# EasyEDA Pro project Propj-AlmuxCybernet.epro, schematic example
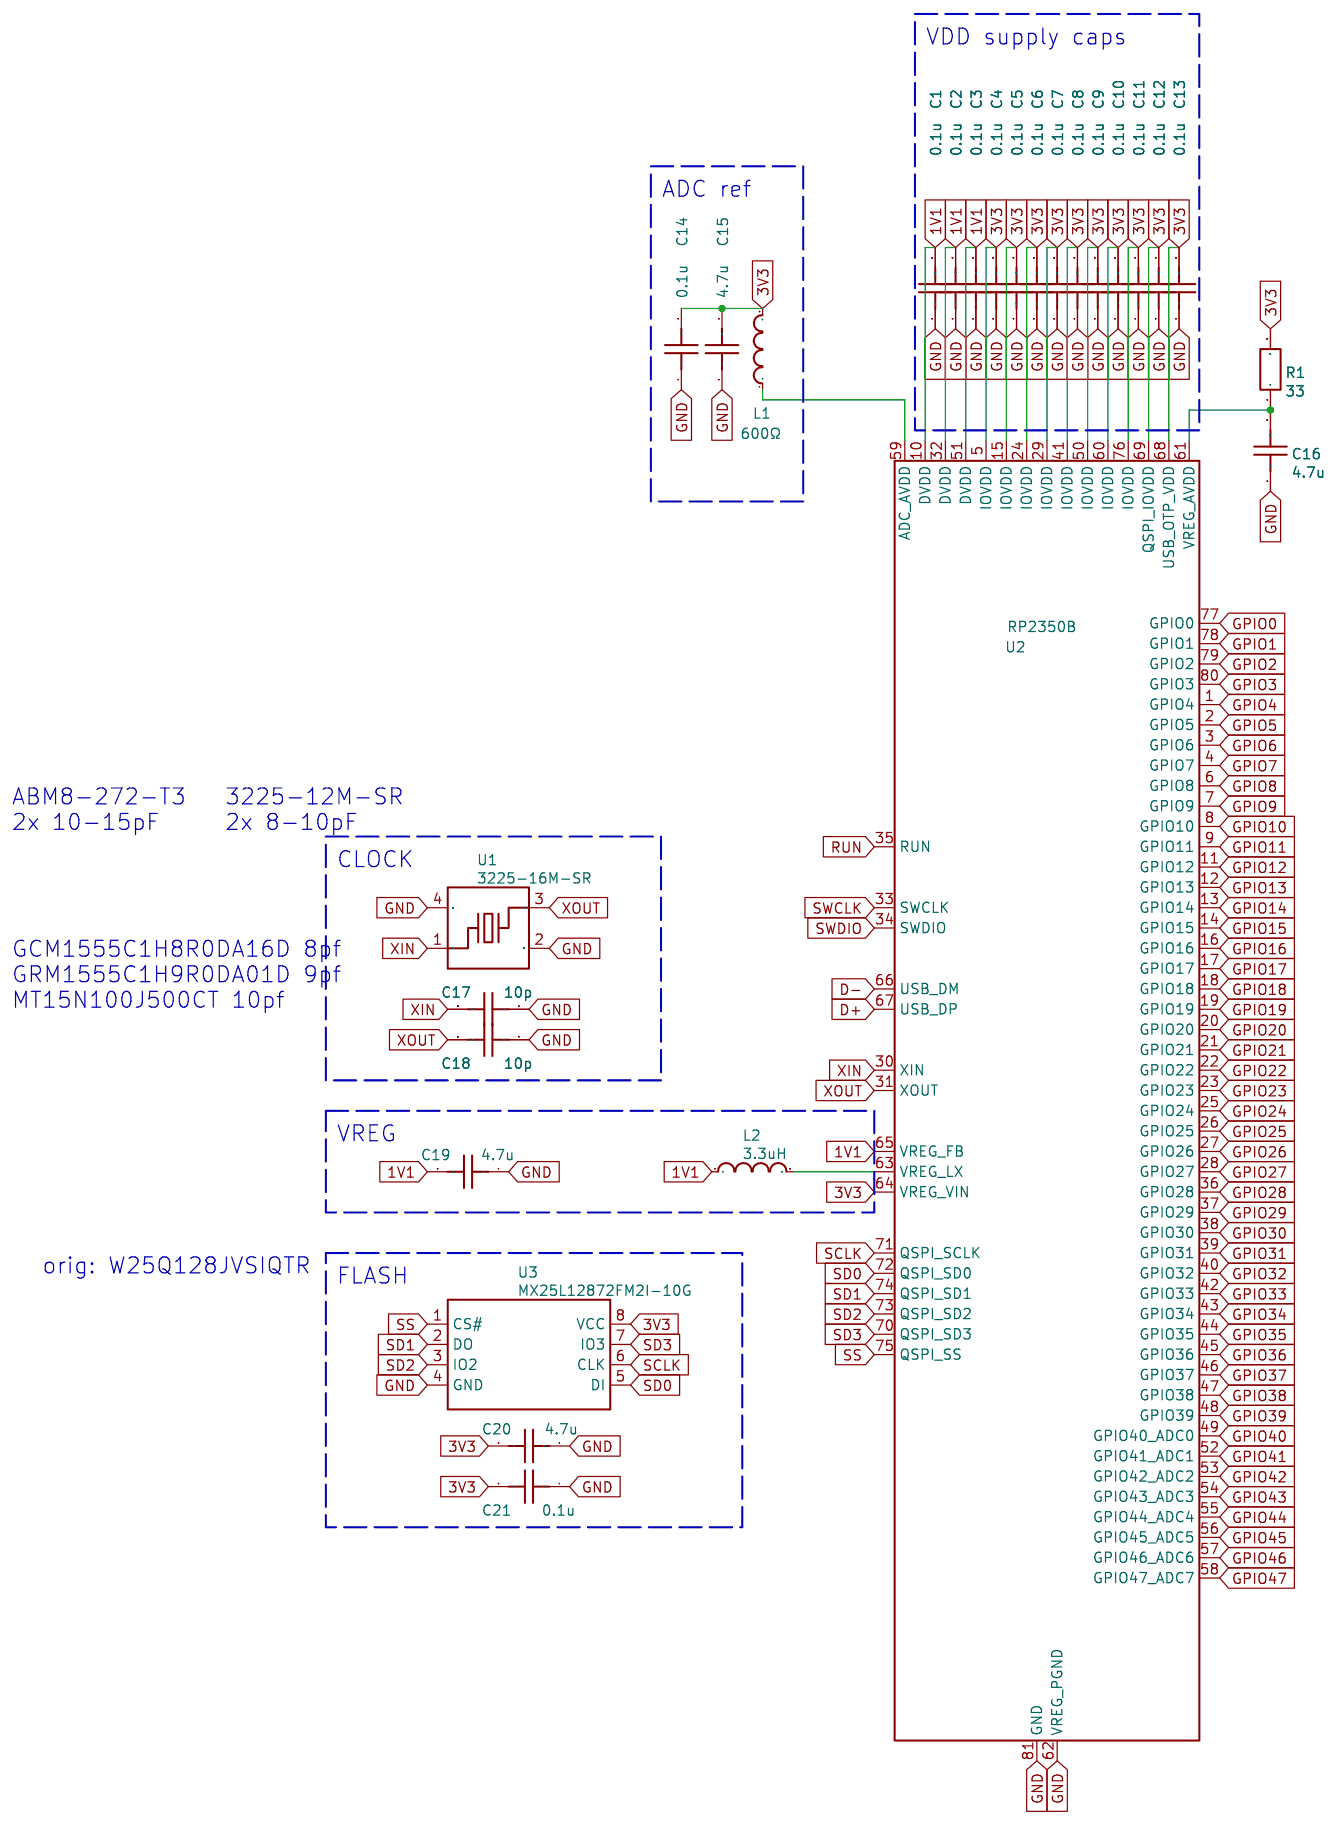
[diagram p0: schematic sheet]

## Parts
C1  0.1u  [C0402]
C2  0.1u  [C0402]
C3  0.1u  [C0402]
C4  0.1u  [C0402]
C5  0.1u  [C0402]
C6  0.1u  [C0402]
C7  0.1u  [C0402]
C8  0.1u  [C0402]
C9  0.1u  [C0402]
C10  0.1u  [C0402]
C11  0.1u  [C0402]
C12  0.1u  [C0402]
C13  0.1u  [C0402]
C14  0.1u  [C0402]
C15  4.7u  [C0603]
C16  4.7u  [C0603]
C17  10p  [C0402]
C18  10p  [C0402]
C19  4.7u  [C0603]
C20  4.7u  [C0603]
C21  0.1u  [C0402]
L1  600Ω  [L0603]
L2  3.3uH  [L1008]
R1  33  [R0402]
U1  3225-16M-SR  [CRYSTAL-SMD_4P-L3.2-W2.5-BL]
U2  RP2350B  [QFN-80_L10.0-W10.0-P0.40-TL-EP3.4]
U3  MX25L12872FM2I-10G  [SOIC-8_L5.3-W5.3-P1.27-LS8.0-BL]

## Library data of the parts
C1-C14 C21 = 0.1u: Supplier Part: CL05B104KP5NNNC; Supplier: Tme; Manufacturer Part: CL05B104KP5NNNC; Manufacturer: SAMSUNG; nameAlias: Value(F); Contributor: LCEDA_Lib; spicePre: C; spiceSymbolName: C_0402_US
C15 C16 C19 C20 = 4.7u: Supplier Part: 0603X475K100CT; Supplier: Tme; Manufacturer Part: 0603X475K100CT; Manufacturer: WALSIN; nameAlias: Value(F); Contributor: LCEDA_Lib; spicePre: C; spiceSymbolName: C_0402_US
C17 C18 = 10p: Supplier Part: MT15N100J500CT; Supplier: Tme; Manufacturer Part: MT15N100J500CT; Manufacturer: WALSIN; nameAlias: Value(F); Contributor: LCEDA_Lib; spicePre: C; spiceSymbolName: C_0402_US
L1 = 600Ω: Supplier: Tme; Manufacturer: muRata; Manufacturer Part: BLM18HE601SN1D; Supplier Part: BLM18HE601SN1D; nameAlias: Value; spicePre: L; spiceSymbolName: BLM18HE601SN1D
L2 = 3.3uH: Supplier: Tme; Supplier Part: LQM2HPN3R3MG0L; Manufacturer: MURATA; Manufacturer Part: LQM2HPN3R3MG0L; nameAlias: Value; Contributor: Nephrite; spicePre: L; spiceSymbolName: AOTA-B201610S3R3-101-T
R1 = 33: Supplier Part: HP02-33R1%; Supplier: Tme; Manufacturer Part: HP02WAF330JTCE; Manufacturer: ROYALOHM; nameAlias: Value(Ω); Contributor: LCEDA_Lib; spicePre: R; spiceSymbolName: R_0402_EU
U1 = 3225-16M-SR: Supplier: Tme; Supplier Part: 3225-12M-SR; Manufacturer: SR Passives; Contributor: lcsc; spicePre: U
U2 = RP2350B: Supplier: LCSC; Supplier Part: C9900136713; Manufacturer: null; Contributor: lcsc; spicePre: U
U3 = MX25L12872FM2I-10G: Supplier: Tme; Manufacturer: RENESAS; Manufacturer Part: AT25SF081B-SSHD-T; Supplier Part: AT25SF081B-SSHD-T; spicePre: U; spiceSymbolName: W25Q128JVSIQTR

## Nets
1V1: C1.2 C2.2 C3.2 C19.2 L2.1 U2.10(DVDD) U2.32(DVDD) U2.51(DVDD) U2.65(VREG_FB)
3V3: C4.2 C5.2 C6.2 C7.2 C8.2 C9.2 C10.2 C11.2 C12.2 C13.2 C14.2 C15.2 C20.2 C21.2 L1.2 R1.2 U2.5(IOVDD) U2.15(IOVDD) U2.24(IOVDD) U2.29(IOVDD) U2.41(IOVDD) U2.50(IOVDD) U2.60(IOVDD) U2.64(VREG_VIN) U2.68(USB_OTP_VDD) U2.69(QSPI_IOVDD) U2.76(IOVDD) U3.8(VCC)
GND: C1.1 C2.1 C3.1 C4.1 C5.1 C6.1 C7.1 C8.1 C9.1 C10.1 C11.1 C12.1 C13.1 C14.1 C15.1 C16.1 C17.1 C18.1 C19.1 C20.1 C21.1 U1.2(GND) U1.4(GND) U2.62(VREG_PGND) U2.81(GND) U3.4(GND)
D+: U2.67(USB_DP)
D-: U2.66(USB_DM)
GPIO0: U2.77(GPIO0)
GPIO1: U2.78(GPIO1)
GPIO2: U2.79(GPIO2)
GPIO3: U2.80(GPIO3)
GPIO4: U2.1(GPIO4)
GPIO5: U2.2(GPIO5)
GPIO6: U2.3(GPIO6)
GPIO7: U2.4(GPIO7)
GPIO8: U2.6(GPIO8)
GPIO9: U2.7(GPIO9)
GPIO10: U2.8(GPIO10)
GPIO11: U2.9(GPIO11)
GPIO12: U2.11(GPIO12)
GPIO13: U2.12(GPIO13)
GPIO14: U2.13(GPIO14)
GPIO15: U2.14(GPIO15)
GPIO16: U2.16(GPIO16)
GPIO17: U2.17(GPIO17)
GPIO18: U2.18(GPIO18)
GPIO19: U2.19(GPIO19)
GPIO20: U2.20(GPIO20)
GPIO21: U2.21(GPIO21)
GPIO22: U2.22(GPIO22)
GPIO23: U2.23(GPIO23)
GPIO24: U2.25(GPIO24)
GPIO25: U2.26(GPIO25)
GPIO26: U2.27(GPIO26)
GPIO27: U2.28(GPIO27)
GPIO28: U2.36(GPIO28)
GPIO29: U2.37(GPIO29)
GPIO30: U2.38(GPIO30)
GPIO31: U2.39(GPIO31)
GPIO32: U2.40(GPIO32)
GPIO33: U2.42(GPIO33)
GPIO34: U2.43(GPIO34)
GPIO35: U2.44(GPIO35)
GPIO36: U2.45(GPIO36)
GPIO37: U2.46(GPIO37)
GPIO38: U2.47(GPIO38)
GPIO39: U2.48(GPIO39)
GPIO40: U2.49(GPIO40_ADC0)
GPIO41: U2.52(GPIO41_ADC1)
GPIO42: U2.53(GPIO42_ADC2)
GPIO43: U2.54(GPIO43_ADC3)
GPIO44: U2.55(GPIO44_ADC4)
GPIO45: U2.56(GPIO45_ADC5)
GPIO46: U2.57(GPIO46_ADC6)
GPIO47: U2.58(GPIO47_ADC7)
RUN: U2.35(RUN)
SCLK: U2.71(QSPI_SCLK) U3.6(CLK)
SD0: U2.72(QSPI_SD0) U3.5(DI)
SD1: U2.74(QSPI_SD1) U3.2(DO)
SD2: U2.73(QSPI_SD2) U3.3(IO2)
SD3: U2.70(QSPI_SD3) U3.7(IO3)
SS: U2.75(QSPI_SS) U3.1(CS#)
SWCLK: U2.33(SWCLK)
SWDIO: U2.34(SWDIO)
XIN: C17.2 U1.1 U2.30(XIN)
XOUT: C18.2 U1.3 U2.31(XOUT)
Net-(C16-2): C16.2 R1.1 U2.61(VREG_AVDD)
Net-(L1-1): L1.1 U2.59(ADC_AVDD)
Net-(L2-2): L2.2 U2.63(VREG_LX)

## Notes on the sheet
- VDD supply caps
- ADC ref
- ABM8-272-T3
  2x 10-15pF
- 3225-12M-SR
  2x 8-10pF
- CLOCK
- GCM1555C1H8R0DA16D 8pf
  GRM1555C1H9R0DA01D 9pf
  MT15N100J500CT 10pf
- VREG
- orig: W25Q128JVSIQTR
- FLASH
